# EAGLE schematic SVmitTreiber3LED2 (EAGLE 6.4)
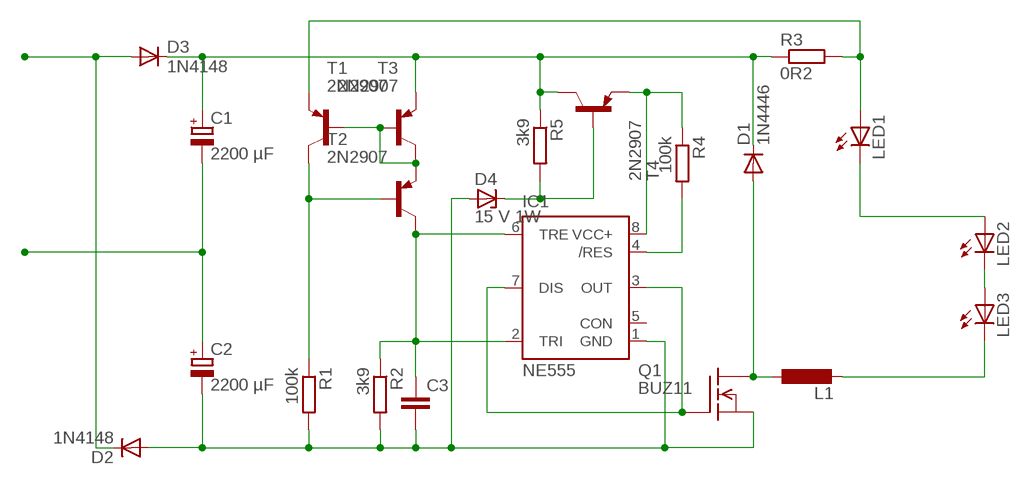
[diagram p0: schematic, sheet 1]

## Parts
C1  2200 µF  CPOL-EUE5-10.5  [E5-10,5]
C2  2200 µF  CPOL-EUE5-10.5  [E5-10,5]
C3  C-EU025-024X044  [C025-024X044]
D1  1N4446  [DO35-10]
D2  1N4148  1N4148DO35-10  [DO35-10]
D3  1N4148  1N4148DO35-10  [DO35-10]
D4  15 V 1W  1N4728  [DO41Z10]
IC1  NE555  [DIL-08]
L1  L-EU6000-XXX-RC  [6000-XXXX-RC]
LED1  LED10MM  [LED10MM]
LED2  LED10MM  [LED10MM]
LED3  LED10MM  [LED10MM]
Q1  BUZ11  [TO220]
R1  100k  R-EU_0207/10  [0207/10]
R2  3k9  R-EU_0207/10  [0207/10]
R3  0R2  R-EU_0207/15  [0207/15]
R4  100k  R-EU_0207/10  [0207/10]
R5  3k9  R-EU_0207/10  [0207/10]
T1  2N2907  [TO18]
T2  2N2907  [TO18]
T3  2N2907  [TO18]
T4  2N2907  [TO18]

## Nets
D1: D2.C D3.A
D2: C1.- C2.+
LV1: LED1.K(C) LED2.A
LV2: C2.- C3.2 D2.A D4.A IC1.1(GND) Q1.3(S) R1.2 R2.2
N$1: C1.+ D1.C D3.C R3.1 R5.1 T1.1(E) T4.3(C)
N$2: T1.2(B) T1.3(C) T2.1(E) T3.2(B)
N$3: R1.1 T2.2(B) T3.3(C)
N$4: C3.1 IC1.2(TRI) IC1.6(TRE) R2.1 T2.3(C)
N$6: IC1.3(OUT) IC1.7(DIS) Q1.1(G)
N$7: IC1.4(/RES) R4.2
N$8: D1.A L1.1 Q1.2(D)
N$9: LED1.A R3.2 T3.1(E)
N$10: D4.C R5.2 T4.2(B)
N$11: LED2.K(C) LED3.A
N$12: IC1.8(VCC+) R4.1 T4.1(E)
SW2LV: L1.2 LED3.K(C)
Unconnected: IC1.5(CON)

## Library data of the parts
C1 C2 = rcl:CPOL-EU: POLARIZED CAPACITOR, European symbol
C3 = rcl:C-EU: CAPACITOR, European symbol
D1 = diode:1N4446: DIODE high speed (Philips)
D2 D3 = diode:1N4148: DIODE high speed (Philips)
D4 = diode:1N4728: Z DIODE 3.3 V, 1W, 5 percent
IC1 = st-microelectronics:NE555: General purpose bipolar Timer; MF: Arrow Electronics; MPN: NE555N; OC_FARNELL: 1467742; OC_NEWARK: 89K1486
L1 = rcl:L-EU: INDUCTOR, European symbol
LED1-LED3 = led:LED: LED OSRAM: - CHIPLED LG R971, LG N971, LY N971, LG Q971, LY Q971, LO R971, LY R971 LH N974, LH R974 LS Q976, LO Q976, LY Q976 LO Q996 - Hyper CHIPLED LW Q18S LB Q993, LB Q99A, LB R99A - SideLED LS A670, LO A670, LY A670, LG A670, LP A670 LB A673, LV A673, LT A673, LW A673 LH A674 LY A675 LS A676, LA A676, LO A676, LY A676, LW A676 LS A679, LY A679, LG A679 - Hyper Micro SIDELED® LS Y876, LA Y876, LO Y876, LY Y876 LT Y87S - SmartLED LW L88C, LW L88S LB L89C, LB L89S, LG L890 LS L89K, LO L89K, LY L89K LS L896, LA L896, LO L896, LY L896 - TOPLED LS T670, LO T670, LY T670, LG T670, LP T670 LSG T670, LSP T670, LSY T670, LOP T670, LYG T670 LG T671, LOG T671, LSG T671 LB T673, LV T673, LT T673, LW T673 LH T674 LS T676, LA T676, LO T676, LY T676, LB T676, LH T676, LSB T676, LW T676 LB T67C, LV T67C, LT T67C, LS T67K, LO T67K, LY T67K, LW E67C LS E67B, LA E67B, LO E67B, LY E67B, LB E67C, LV E67C, LT E67C LW T67C LS T679, LY T679, LG T679 LS T770, LO T770, LY T770, LG T770, LP T770 LB T773, LV T773, LT T773, LW T773 LH T774 LS E675, LA E675, LY E675, LS T675 LS T776, LA T776, LO T776, LY T776, LB T776 LHGB T686 LT T68C, LB T68C - Hyper Mini TOPLED® LB M676 - Mini TOPLED Santana® LG M470 LS M47K, LO M47K, LY M47K Source: http://www.osram.convergy.de LUXEON: - LUMILED® LXK2-PW12-R00, LXK2-PW12-S00, LXK2-PW14-U00, LXK2-PW14-V00 LXK2-PM12-R00, LXK2-PM12-S00, LXK2-PM14-U00 LXK2-PE12-Q00, LXK2-PE12-R00, LXK2-PE12-S00, LXK2-PE14-T00, LXK2-PE14-U00 LXK2-PB12-K00, LXK2-PB12-L00, LXK2-PB12-M00, LXK2-PB14-N00, LXK2-PB14-P00, LXK2-PB14-Q00 LXK2-PR12-L00, LXK2-PR12-M00, LXK2-PR14-Q00, LXK2-PR14-R00 LXK2-PD12-Q00, LXK2-PD12-R00, LXK2-PD12-S00 LXK2-PH12-R00, LXK2-PH12-S00 LXK2-PL12-P00, LXK2-PL12-Q00, LXK2-PL12-R00 Source: www.luxeon.com KINGBRIGHT: KA-3528ASYC Source: www.kingbright.com
Q1 = transistor-fet:BUZ11: N-Channel Enhancement MOSFET 50V; 30A; 0,040Ohm
R1-R5 = rcl:R-EU_: RESISTOR, European symbol
T1-T4 = transistor-pnp:2N2907*: PNP Transistor